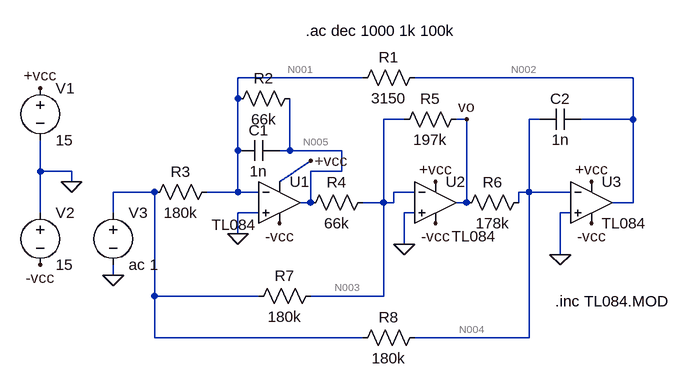
[diagram p0: schematic sim_etapa3.asc]
sim_etapa3.asc, the LTspice schematic file:
Version 4
SHEET 1 880 680
WIRE 128 -48 -64 -48
WIRE 544 -48 208 -48
WIRE -64 -16 -64 -48
WIRE 192 16 160 16
WIRE 288 16 272 16
WIRE 400 16 384 16
WIRE 544 16 544 -48
WIRE 544 16 464 16
WIRE -64 64 -64 -16
WIRE 16 64 16 -16
WIRE 16 64 0 64
WIRE 96 64 16 64
WIRE -368 96 -368 48
WIRE -320 96 -368 96
WIRE 96 96 96 64
WIRE 96 96 48 96
WIRE -320 112 -320 96
WIRE 0 112 48 80
WIRE -192 128 -256 128
WIRE -64 128 -64 64
WIRE -64 128 -112 128
WIRE -32 128 -64 128
WIRE 208 128 176 128
WIRE 384 128 384 16
WIRE 384 128 368 128
WIRE 448 128 384 128
WIRE 48 144 48 96
WIRE 48 144 32 144
WIRE 160 144 160 16
WIRE 160 144 128 144
WIRE 176 144 176 128
WIRE 176 144 160 144
WIRE 288 144 288 16
WIRE 288 144 272 144
WIRE 368 144 368 128
WIRE 544 144 544 16
WIRE 544 144 512 144
WIRE -368 160 -368 96
WIRE -256 160 -256 128
WIRE -32 160 -64 160
WIRE 208 160 192 160
WIRE 448 160 432 160
WIRE -64 192 -64 160
WIRE 192 208 192 160
WIRE 432 224 432 160
WIRE -256 256 -256 240
WIRE -192 288 -192 128
WIRE -32 288 -192 288
WIRE 160 288 160 144
WIRE 160 288 48 288
WIRE -192 352 -192 288
WIRE 128 352 -192 352
WIRE 384 352 384 128
WIRE 384 352 208 352
FLAG -64 192 0
FLAG 192 208 0
FLAG 432 224 0
FLAG -320 112 0
FLAG -368 -32 +vcc
FLAG -368 240 -vcc
FLAG 48 80 +vcc
FLAG 240 112 +vcc
FLAG 480 112 +vcc
FLAG 0 176 -vcc
FLAG 240 176 -vcc
FLAG 480 176 -vcc
FLAG -256 256 0
FLAG 288 16 vo
SYMBOL Opamps\\opamp2 0 80 R0
WINDOW 3 -104 98 Left 2
SYMATTR Value TL084
SYMATTR InstName U1
SYMBOL Opamps\\opamp2 240 80 R0
WINDOW 3 25 116 Left 2
SYMATTR Value TL084
SYMATTR InstName U2
SYMBOL Opamps\\opamp2 480 80 R0
SYMATTR InstName U3
SYMATTR Value TL084
SYMBOL res -96 112 R90
WINDOW 0 0 56 VBottom 2
WINDOW 3 32 56 VTop 2
SYMATTR InstName R3
SYMATTR Value 180k
SYMBOL cap 0 48 R90
WINDOW 0 0 32 VBottom 2
WINDOW 3 32 32 VTop 2
SYMATTR InstName C1
SYMATTR Value 1n
SYMBOL cap 464 0 R90
WINDOW 0 0 32 VBottom 2
WINDOW 3 32 32 VTop 2
SYMATTR InstName C2
SYMATTR Value 1n
SYMBOL res 64 272 R90
WINDOW 0 0 56 VBottom 2
WINDOW 3 32 56 VTop 2
SYMATTR InstName R7
SYMATTR Value 180k
SYMBOL res 144 128 R90
WINDOW 0 0 56 VBottom 2
WINDOW 3 32 56 VTop 2
SYMATTR InstName R4
SYMATTR Value 66k
SYMBOL res 224 336 R90
WINDOW 0 0 56 VBottom 2
WINDOW 3 32 56 VTop 2
SYMATTR InstName R8
SYMATTR Value 180k
SYMBOL res 288 0 R90
WINDOW 0 0 56 VBottom 2
WINDOW 3 32 56 VTop 2
SYMATTR InstName R5
SYMATTR Value 197k
SYMBOL res 384 128 R90
WINDOW 0 0 56 VBottom 2
WINDOW 3 32 56 VTop 2
SYMATTR InstName R6
SYMATTR Value 178k
SYMBOL res 224 -64 R90
WINDOW 0 0 56 VBottom 2
WINDOW 3 32 56 VTop 2
SYMATTR InstName R1
SYMATTR Value 3150
SYMBOL res 32 -32 R90
WINDOW 0 0 56 VBottom 2
WINDOW 3 32 56 VTop 2
SYMATTR InstName R2
SYMATTR Value 66k
SYMBOL voltage -368 -48 R0
SYMATTR InstName V1
SYMATTR Value 15
SYMBOL voltage -368 144 R0
SYMATTR InstName V2
SYMATTR Value 15
SYMBOL voltage -256 144 R0
SYMATTR InstName V3
SYMATTR Value ac 1
TEXT 424 296 Left 2 !.inc TL084.MOD
TEXT 40 -120 Left 2 !.ac dec 1000 1k 100k

The netlist it stands for:
* sim_etapa3.asc
XU1 0 N001 +vcc -vcc N005 TL084  ; pins In+ In- V+ V- OUT
XU2 0 N003 +vcc -vcc vo TL084  ; pins In+ In- V+ V- OUT
XU3 0 N004 +vcc -vcc N002 TL084  ; pins In+ In- V+ V- OUT
R3 N001 N006 180k
C1 N005 N001 1n
C2 N002 N004 1n
R7 N003 N006 180k
R4 N003 N005 66k
R8 N004 N006 180k
R5 vo N003 197k
R6 N004 vo 178k
R1 N002 N001 3150
R2 N005 N001 66k
V1 +vcc 0 15
V2 0 -vcc 15
V3 N006 0 ac 1
.inc TL084.MOD
.ac dec 1000 1k 100k
.backanno
.end

* Results of the author's LTspice run, read from the files saved beside the schematic
* Operating Point, zero values left out:
*   V(n005) = 11.65 µV
*   V(-vcc) = -15 V
*   V(+vcc) = 15 V
*   V(n001) = 10.97 µV
*   V(vo) = 29.84 µV
*   V(n003) = 10.97 µV
*   V(n002) = 11.27 µV
*   V(n004) = 10.97 µV
*   I(R2) = 10.22 pA
*   I(R1) = 95.78 pA
*   I(R6) = -106 pA
*   I(R5) = 95.78 pA
*   I(R8) = 60.95 pA
*   I(R4) = -10.22 pA
*   I(R7) = 60.95 pA
*   I(R3) = 60.95 pA
*   I(V3) = 182.8 pA
*   I(V2) = -42.58 mA
*   I(V1) = -42.58 mA
*   Ix(u1:1) = 45.05 pA
*   Ix(u1:2) = 45.05 pA
*   Ix(u1:3) = 14.19 mA
*   Ix(u1:4) = -14.19 mA
*   Ix(u1:5) = -20.44 pA
*   Ix(u2:1) = 45.05 pA
*   Ix(u2:2) = 45.05 pA
*   Ix(u2:3) = 14.19 mA
*   Ix(u2:4) = -14.19 mA
*   Ix(u2:5) = -201.8 pA
*   Ix(u3:1) = 45.05 pA
*   Ix(u3:2) = 45.05 pA
*   Ix(u3:3) = 14.19 mA
*   Ix(u3:4) = -14.19 mA
*   Ix(u3:5) = -95.78 pA
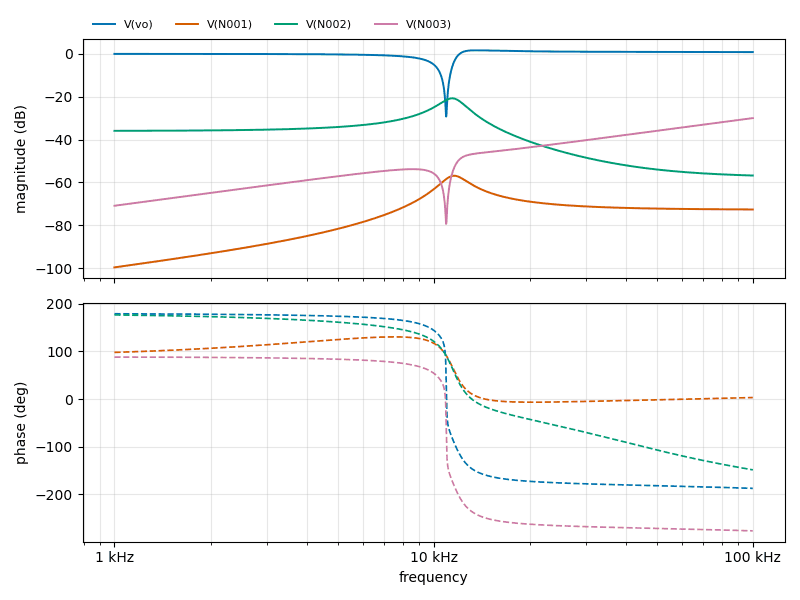
[diagram p1: AC Analysis of sim_etapa3.asc, plotted from the saved traces]
* AC Analysis, 1 run:
*   V(vo): -0.11 dB at 1 kHz, 0.72 dB at 100 kHz, peak 1.56 dB at 13.61 kHz, 3 dB below the peak at 11.83 kHz
*   V(N001): -99.55 dB at 1 kHz, -72.57 dB at 100 kHz, peak -56.86 dB at 11.59 kHz, 3 dB below the peak at 10.64 kHz and 12.81 kHz
*   V(N002): -35.95 dB at 1 kHz, -56.76 dB at 100 kHz, peak -20.80 dB at 11.43 kHz, 3 dB below the peak at 10.34 kHz and 12.45 kHz
*   V(N003): -70.84 dB at 1 kHz, -30.01 dB at 100 kHz, peak -30.01 dB at 100 kHz, 3 dB below the peak at 70.33 kHz